# EAGLE schematic ESLv2 (EAGLE 9.6.2)
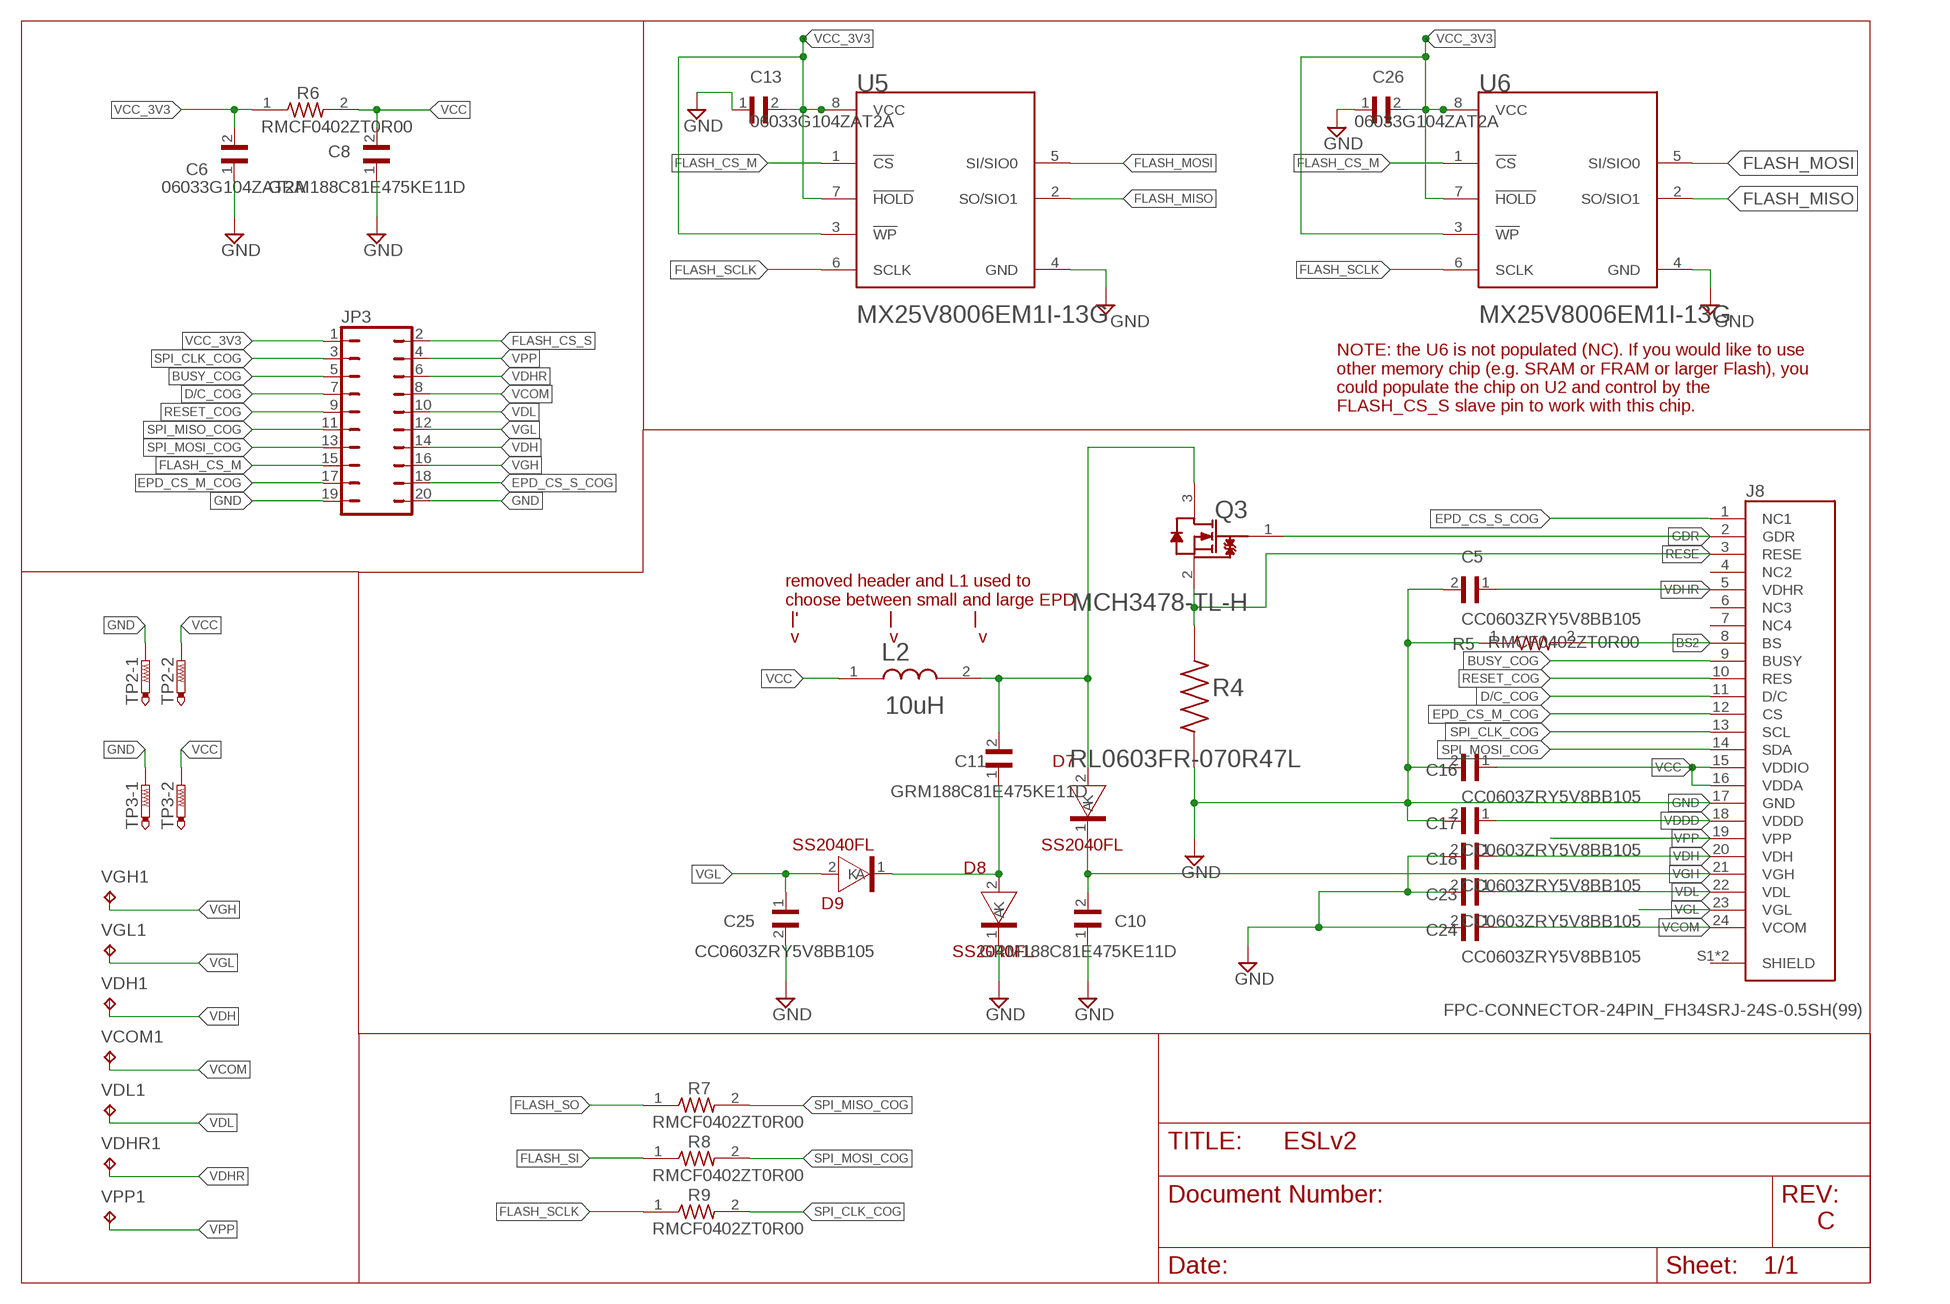
[diagram p0: schematic, sheet 1]

## Parts
C5  CC0603ZRY5V8BB105  [CAPC1608X90]
C6  06033G104ZAT2A  [CAPC1608X90N]
C8  GRM188C81E475KE11D  [CAPC1608X100N]
C10  GRM188C81E475KE11D  [CAPC1608X100N]
C11  GRM188C81E475KE11D  [CAPC1608X100N]
C13  06033G104ZAT2A  [CAPC1608X90N]
C16  CC0603ZRY5V8BB105  [CAPC1608X90]
C17  CC0603ZRY5V8BB105  [CAPC1608X90]
C18  CC0603ZRY5V8BB105  [CAPC1608X90]
C23  CC0603ZRY5V8BB105  [CAPC1608X90]
C24  CC0603ZRY5V8BB105  [CAPC1608X90]
C25  CC0603ZRY5V8BB105  [CAPC1608X90]
C26  06033G104ZAT2A  [CAPC1608X90N]
D7  SS2040FL  [SOD-123FL]
D8  SS2040FL  [SOD-123FL]
D9  SS2040FL  [SOD-123FL]
J8  FPC-CONNECTOR-24PIN_FH34SRJ-24S-0.5SH(99)  [FPC-CONNECTOR-24PIN_HRS_FH34SRJ-24S-0.5SH(99)]
JP3  JP10Q  [JP10Q]
L2  MURATA_LQH3NPZ100MMELMURATA_LQH3NPZ100MMEL_0_0  [MURATA_LQH3NPZ100MMEL_0]
Q3  ON_SEMICONDUCTOR_MCH3478-TL-HON_SEMICONDUCTOR_MCH3478-TL-H_0_0  [ON_SEMICONDUCTOR_MCH3478-TL-H_0]
R4  RL0603FR-070R47L  [RESC1608X55N]
R5  RMCF0402ZT0R00  [RESC1005X40]
R6  RMCF0402ZT0R00  [RESC1005X40]
R7  RMCF0402ZT0R00  [RESC1005X40]
R8  RMCF0402ZT0R00  [RESC1005X40]
R9  RMCF0402ZT0R00  [RESC1005X40]
TP2  PTR2  [P2-38-17]
TP3  PTR2  [P2-38-17]
U5  MACRONIX_MX25V8006EM1I-13GMACRONIX_MX25V8006EM1I-13G_0_0  [MACRONIX_MX25V8006EM1I-13G_0]
U6  MACRONIX_MX25V8006EM1I-13GMACRONIX_MX25V8006EM1I-13G_0_0  [MACRONIX_MX25V8006EM1I-13G_0]
VCOM1  TPB1,27  [B1,27]
VDH1  TPB1,27  [B1,27]
VDHR1  TPB1,27  [B1,27]
VDL1  TPB1,27  [B1,27]
VGH1  TPB1,27  [B1,27]
VGL1  TPB1,27  [B1,27]
VPP1  TPB1,27  [B1,27]

## Nets
BS2: C6.1 C8.1 C10.1 C13.1 C25.2 C26.1 D8.1(K) J8.8(BS) R5.2 U5.4(GND) U6.4(GND) ; supply symbol labelled GND
BUSY_COG: J8.9(BUSY) JP3.5
D/C_COG: J8.11(D/C) JP3.7
EPD_CS_M_COG: J8.12(CS) JP3.17
EPD_CS_S_COG: J8.1(NC1) JP3.18
FLASH_CS_M: JP3.15 U5.1(!CS!) U6.1(!CS!)
FLASH_CS_S: JP3.2
FLASH_MISO: U5.2(SO/SIO1) U6.2(SO/SIO1)
FLASH_MOSI: U5.5(SI/SIO0) U6.5(SI/SIO0)
FLASH_SCLK: R9.1 U5.6(SCLK) U6.6(SCLK)
FLASH_SI: R8.1
FLASH_SO: R7.1
GDR: J8.2(GDR) Q3.1(G)
GND: C5.2 C16.2 C17.2 C18.2 C23.2 C24.2 J8.17(GND) JP3.19 JP3.20 R4.1 R5.1 TP2.TP-1 TP3.TP-1
N$1: C11.2 D7.2(A) L2.2 Q3.3(D)
N$15: C11.1 D8.2(A) D9.1(K)
RESE: J8.3(RESE) Q3.2(S) R4.2
RESET_COG: J8.10(RES) JP3.9
SPI_CLK_COG: J8.13(SCL) JP3.3 R9.2
SPI_MISO_COG: JP3.11 R7.2
SPI_MOSI_COG: J8.14(SDA) JP3.13 R8.2
VCC: C8.2 C16.1 J8.15(VDDIO) J8.16(VDDA) L2.1 R6.2 TP2.TP-2 TP3.TP-2
VCC_3V3: C6.2 C13.2 C26.2 JP3.1 R6.1 U5.3(!WP!) U5.7(!HOLD!) U5.8(VCC) U6.3(!WP!) U6.7(!HOLD!) U6.8(VCC)
VCOM: C24.1 J8.24(VCOM) JP3.8 VCOM1.TP
VDDD: C17.1 J8.18(VDDD)
VDH: C18.1 J8.20(VDH) JP3.14 VDH1.TP
VDHR: C5.1 J8.5(VDHR) JP3.6 VDHR1.TP
VDL: C23.1 J8.22(VDL) JP3.10 VDL1.TP
VGH: C10.2 D7.1(K) J8.21(VGH) JP3.16 VGH1.TP
VGL: C25.1 D9.2(A) J8.23(VGL) JP3.12 VGL1.TP
VPP: J8.19(VPP) JP3.4 VPP1.TP
Unconnected: J8.4(NC2) J8.6(NC3) J8.7(NC4) J8.S1(SHIELD) J8.S2(SHIELD)

## Notes on the sheet
- NOTE: the U6 is not populated (NC). If you would like to use 
  other memory chip (e.g. SRAM or FRAM or larger Flash), you 
  could populate the chip on U2 and control by the 
  FLASH_CS_S slave pin to work with this chip.
- removed header and L1 used to 
  choose between small and large EPD
   |'                  |                |
   v                  v                v
- C

## Library data of the parts
C5 C16-C18 C23-C25 = CAP 1uF:CC0603ZRY5V8BB105: Cap 1uF 25VDC Y5V -20% to 80% SMD 0603 Paper T/R; DESCRIPTION: 1µF -20%, +80% 25V Ceramic Capacitor Y5V (F) 0603 (1608 Metric); DIGI-KEY_PART_NUMBER: 311-1829-1-ND; MF: Yageo; MP: CC0603ZRY5V8BB105; PACKAGE: 0603 Yageo; PURCHASE-URL: https://pricing.snapeda.com/search/part/CC0603ZRY5V8BB105/?ref=eda
C6 C13 C26 = CAP 100nF:06033G104ZAT2A: 0603 100 nF 25 V -20 / +80 % Tolerance Y5V SMT Multilayer Ceramic Capacitor; DESCRIPTION: Cap Ceramic 0.1uF 25V Y5V -20% to 80% Pad SMD 0603 85°C T/R; MF: AVX; MP: 06033G104ZAT2A; PACKAGE: None; PURCHASE-URL: https://pricing.snapeda.com/search/part/06033G104ZAT2A/?ref=eda
C8 C10 C11 = CAP 4.7uF:GRM188C81E475KE11D: Cap Ceramic 4.7uF 25V X6S 10% Pad SMD 0603 105C T/R Check prices <https://pricing.snapeda.com/parts/GRM188C81E475KE11D/Murata/view-part?ref=eda>; AVAILABILITY: In Stock; DESCRIPTION: SMD Capacitor X6S(EIA) with Capacitance: 4.7uF Tol. 10%. Rated Voltage: 25Vdc; MF: Murata; MP: GRM188C81E475KE11D; PACKAGE: 1608 Murata; PRICE: None; PURCHASE-URL: https://pricing.snapeda.com/search/part/GRM188C81E475KE11D/?ref=eda
D7-D9 = DIODE:SS2040FL: Check prices <https://pricing.snapeda.com/parts/SS2040FL/Panjit/view-part?ref=eda>; AVAILABILITY: In Stock; DESCRIPTION: Schottky Diodes & Rectifiers GP/TR/13/RoHS/10K/SOD-123FL/SKY/SOD/SSM-20AAFL/SSM20FL-QI02/PJ///; MF: Panjit; MP: SS2040FL; PACKAGE: None; PRICE: None; PURCHASE-URL: https://pricing.snapeda.com/search/part/SS2040FL/?ref=eda
J8 = ESL:FPC-CONNECTOR-24PIN_FH34SRJ-24S-0.5SH(99): FFC & FPC Connectors Check prices <https://pricing.snapeda.com/parts/FH34SRJ-24S-0.5SH%2899%29/Hirose%20Electric/view-part?ref=eda>; AVAILABILITY: In Stock; DESCRIPTION: 24 Position FFC, FPC Connector Contacts, Top and Bottom 0.020 (0.50mm) Surface Mount, Right Angle; MF: Hirose Electric; MP: FH34SRJ-24S-0.5SH(99); PACKAGE: None; PRICE: None; PURCHASE-URL: https://pricing.snapeda.com/search/part/FH34SRJ-24S-0.5SH(99)/?ref=eda
JP3 = jumper:JP10Q: JUMPER
L2 = IND 10uH:MURATA_LQH3NPZ100MMEL: Wire Wound Ferrite Inductor for Power Lines For Automotive 10μH ±20% 0.228Ω 1280mA 1212; AMBIENT_TEMPERATURE_RANGE_HIGH: +105°C; AMBIENT_TEMPERATURE_RANGE_LOW: -40°C; AUTOMOTIVE: Yes; AUTOMOTIVE_GRADE: Grade 1; CENTROID_NOT_SPECIFIED: No; COMPOSITION: Wirewound; CORE_MATERIAL: Ferrite; DATASHEET: https://www.murata.com/en-us/products/productdetail?partno=LQH3NPZ100MME%23; DEVICE_CLASS_L1: Passive Components; DEVICE_CLASS_L2: Inductors; DEVICE_CLASS_L3: Fixed Inductors; FOOTPRINT_VARIANT_NAME_0: Recommended_Land_Pattern; HEIGHT: 1.5mm; INDUCTANCE: 10uH; LEAD_FREE: Yes; MF: Murata; MFG_PACKAGE_IDENT: LQH3NPH_ME; MFG_PACKAGE_IDENT_COMPONENT_ID: a63315cd171c542c; MFG_PACKAGE_IDENT_DATE: 0; MFG_PACKAGE_IDENT_REV: 0; MPN: LQH3NPZ100MMEL; PACKAGE: 1212.0; PREFIX: L; RMS_CURRENT: 1280mA; ROHS: Yes; SATURATION_CURRENT: 810mA; SELF_RESONANT_FREQUENCY: 20MHz; SERIES_RESISTANCE: 0.228Ω; SHIELDING: true; TEMPERATURE_RANGE_HIGH: +125°C; TEMPERATURE_RANGE_LOW: -40°C; TEST_FREQUENCY: 1MHz; TOLERANCE: 0.2; VERIFICATION_VERSION: 0.0.0.3
Q3 = MOSFET:ON_SEMICONDUCTOR_MCH3478-TL-H: ONSC-NMOS-G1S2D3-3_J; CHANNEL_POLARITY: N Channel; CIIVA_IDS: 837008; CISS_TYP_PF: 130; COMPONENT_LINK_1_DESCRIPTION: Manufacturer URL; COMPONENT_LINK_1_URL: http://www.onsemi.com/; COMPONENT_LINK_3_DESCRIPTION: Package Specification; COMPONENT_LINK_3_URL: http://www.onsemi.com/pub_link/Collateral/EN7354-D.PDF; CONFIGURATION: Single; COSS_TYP_PF: 21; CRSS_TYP_PF: 14; DATASHEET: http://www.onsemi.cn/pub_link/Collateral/ENAA1353-D.PDF; FOOTPRINT_VARIANT_NAME_0: Manufacturer Recommended; IMPORTED: yes; IMPORTED_FROM: vault; IMPORT_TS: 1521851194; MF: On Semiconductor; MOUNTING_TECHNOLOGY: Surface Mount; MPN: MCH3478-TL-H; PACKAGE: MCPH-3; PACKAGE_DESCRIPTION: 3-Pin Small Outline Transistor, Body 2 x 1.6 mm, Pitch 0.65 mm; PACKAGE_TYPE: SC-70FL / MCPH-3; PACKING: Tape and Reel; PREFIX: Q; RELEASE_DATE: 1407149804; ROHS: No; VAULT_GUID: 93CF8D5F-116E-4A84-9C4D-567819B75567; VAULT_REVISION: 4F433114-B412-42D1-93FA-4D10C81BF666; VBRDSS_MIN_V: 30; VGSTH_MAX_V: 1.3; VGS_MAX_V: 12
R4 = RES .47ohm:RL0603FR-070R47L: Surface Mount Thick Film Resistor, RL Series, 0.47 ohm, 100 mW, - 1%, 50 V, 0603 [1608 Metric] Check prices <https://pricing.snapeda.com/parts/RL0603FR-070R47L/Yageo/view-part?ref=eda>; AVAILABILITY: In Stock; DESCRIPTION: 470 mOhms ±1% 0.1W, 1/10W Chip Resistor 0603 (1608 Metric) Automotive AEC-Q200, Current Sense, Moisture Resistant Thick Film; MF: Yageo; MP: RL0603FR-070R47L; PACKAGE: 1608 Yageo; PRICE: None; PURCHASE-URL: https://pricing.snapeda.com/search/part/RL0603FR-070R47L/?ref=eda
R5-R9 = RMCF0402ZT0R00:RMCF0402ZT0R00: General Purpose Thick Film Surface Mount Chip Resistor Check prices <https://pricing.snapeda.com/parts/RMCF0402ZT0R00/Stackpole%20Electronics/view-part?ref=eda>; AVAILABILITY: In Stock; DESCRIPTION: 0 Ohms Jumper 0.063W, 1/16W Chip Resistor 0402 (1005 Metric) Automotive AEC-Q200 Thick Film; MF: Stackpole Electronics; MP: RMCF0402ZT0R00; PACKAGE: 0402 Stackpole Electronics; PRICE: None; PURCHASE-URL: https://pricing.snapeda.com/search/part/RMCF0402ZT0R00/?ref=eda
TP2 TP3 = testpad:PTR2: TEST PIN
U5 U6 = Flash Memory:MACRONIX_MX25V8006EM1I-13G: FLASH - NOR Memory IC 8Mb (1M x 8) SPI 75MHz 8-SOP; 3DS_PART_NUMBER: 521-00003; ACCESS_TIME: 9us; AMBIENT_TEMPERATURE_RANGE_HIGH: +85°C; AMBIENT_TEMPERATURE_RANGE_LOW: -40°C; CENTROID_NOT_SPECIFIED: No; DATASHEET: https://media.digikey.com/pdf/Data%20Sheets/Macronix/MX25V8006E.pdf; DEVICE_CLASS_L1: Integrated Circuits (ICs); DEVICE_CLASS_L2: Memory; DEVICE_CLASS_L3: Flash; DIGIKEY_DESCRIPTION: IC FLASH 8MBIT 75MHZ 8SOP; DIGIKEY_PART_NUMBER: 1092-1118-ND; FOOTPRINT_PARAMETERS_0: {"fp_type":"SOIC_mini","params":{"N":{"nom":8,"long name":"Number of leads","min":null,"max":null,"short name":"N","type":"count"},"A":{"nom":false,"long name":"Height","min":false,"max":1750000,"short name":"A","type":"measurement"},"A1":{"nom":150000,"long name":"Package clearance","min":100000,"max":200000,"short name":"A1","type":"measurement"},"A2":{"nom":1450000,"long name":"Package height","min":1350000,"max":1550000,"short name":"A2","type":"measurement"},"D":{"nom":4900000,"long name":"Package length","min":4770000,"max":5030000,"short name":"D","type":"measurement"},"E":{"nom":5990000,"long name":"Width w/ leads","min":5800000,"max":6200000,"short name":"E","type":"measurement"},"E1":{"nom":3900000,"long name":"Package width","min":3800000,"max":4000000,"short name":"E1","type":"measurement"},"B":{"nom":410000,"long name":"Lead width","min":360000,"max":510000,"short name":"B","type":"measurement"},"C":{"nom":200000,"long name":"Lead thickness","min":150000,"max":250000,"short name":"C","type":"measurement"},"e":{"nom":1270000,"long name":"Lead pitch","min":null,"max":null,"short name":"e","type":"measurement"},"L":{"nom":660000,"long name":"Lead foot length","min":460000,"max":860000,"short name":"L","type":"measurement"},"PHI":{"nom":5,"long name":"Lead foot angle","min":0,"max":8,"short name":"PHI","type":"measurement"},"HT":{"default":"No","long name":"Thermal pad","type":"multichoiceparent","short name":"HT","children":[]},"offset x":{"nom":0,"long name":"X Center offset","min":null,"max":null,"short name":"offset x","type":"measurement"},"offset y":{"nom":0,"long name":"Y Center offset","min":null,"max":null,"short name":"offset y","type":"measurement"},"LS":{"default":"Rounded rectangle","long name":"Land shape","type":"multichoice","short name":"LS"},"LS1":{"default":"Rectangle","long name":"Land shape (Pin 1)","type":"multichoice","short name":"LS1"},"solder toe":{"nom":550000,"long name":"Solder fillet (toe)","min":null,"max":null,"short name":"solder toe","type":"fixedmeasurement"},"solder heel":{"nom":450000,"long name":"Solder fillet (heel)","min":null,"max":null,"short name":"solder heel","type":"fixedmeasurement"},"solder side":{"nom":50000,"long name":"Solder fillet (side)","min":null,"max":null,"short name":"solder side","type":"fixedmeasurement"},"courtyard":{"nom":500000,"long name":"Courtyard","min":null,"max":null,"short name":"courtyard","type":"fixedmeasurement"},"SF":{"default":"A","long name":"Packing level","type":"multichoiceparent","short name":"SF","help":"http://support.upverter.com/customer/portal/articles/978783-what-is-a-footprint-packing-level","children":["solder toe","solder heel","solder side","courtyard"]}}}; FOOTPRINT_PARAMETERS_1: {"fp_type":"SOIC_mini","params":{"N":{"nom":8,"long name":"Number of leads","min":null,"max":null,"short name":"N","type":"count"},"A":{"nom":false,"long name":"Height","min":false,"max":1750000,"short name":"A","type":"measurement"},"A1":{"nom":150000,"long name":"Package clearance","min":100000,"max":200000,"short name":"A1","type":"measurement"},"A2":{"nom":1450000,"long name":"Package height","min":1350000,"max":1550000,"short name":"A2","type":"measurement"},"D":{"nom":4900000,"long name":"Package length","min":4770000,"max":5030000,"short name":"D","type":"measurement"},"E":{"nom":5990000,"long name":"Width w/ leads","min":5800000,"max":6200000,"short name":"E","type":"measurement"},"E1":{"nom":3900000,"long name":"Package width","min":3800000,"max":4000000,"short name":"E1","type":"measurement"},"B":{"nom":410000,"long name":"Lead width","min":360000,"max":510000,"short name":"B","type":"measurement"},"C":{"nom":200000,"long name":"Lead thickness","min":150000,"max":250000,"short name":"C","type":"measurement"},"e":{"nom":1270000,"long name":"Lead pitch","min":null,"max":null,"short name":"e","type":"measurement"},"L":{"nom":660000,"long name":"Lead foot length","min":460000,"max":860000,"short name":"L","type":"measurement"},"PHI":{"nom":5,"long name":"Lead foot angle","min":0,"max":8,"short name":"PHI","type":"measurement"},"HT":{"default":"No","long name":"Thermal pad","type":"multichoiceparent","short name":"HT","children":[]},"offset x":{"nom":0,"long name":"X Center offset","min":null,"max":null,"short name":"offset x","type":"measurement"},"offset y":{"nom":0,"long name":"Y Center offset","min":null,"max":null,"short name":"offset y","type":"measurement"},"LS":{"default":"Rounded rectangle","long name":"Land shape","type":"multichoice","short name":"LS"},"LS1":{"default":"Rectangle","long name":"Land shape (Pin 1)","type":"multichoice","short name":"LS1"},"solder toe":{"nom":350000,"long name":"Solder fillet (toe)","min":null,"max":null,"short name":"solder toe","type":"fixedmeasurement"},"solder heel":{"nom":350000,"long name":"Solder fillet (heel)","min":null,"max":null,"short name":"solder heel","type":"fixedmeasurement"},"solder side":{"nom":30000,"long name":"Solder fillet (side)","min":null,"max":null,"short name":"solder side","type":"fixedmeasurement"},"courtyard":{"nom":250000,"long name":"Courtyard","min":null,"max":null,"short name":"courtyard","type":"fixedmeasurement"},"SF":{"default":"B","long name":"Packing level","type":"multichoiceparent","short name":"SF","help":"http://support.upverter.com/customer/portal/articles/978783-what-is-a-footprint-packing-level","children":["solder toe","solder heel","solder side","courtyard"]}}}; FOOTPRINT_PARAMETERS_2: {"fp_type":"SOIC_mini","params":{"N":{"nom":8,"long name":"Number of leads","min":null,"max":null,"short name":"N","type":"count"},"A":{"nom":false,"long name":"Height","min":false,"max":1750000,"short name":"A","type":"measurement"},"A1":{"nom":150000,"long name":"Package clearance","min":100000,"max":200000,"short name":"A1","type":"measurement"},"A2":{"nom":1450000,"long name":"Package height","min":1350000,"max":1550000,"short name":"A2","type":"measurement"},"D":{"nom":4900000,"long name":"Package length","min":4770000,"max":5030000,"short name":"D","type":"measurement"},"E":{"nom":5990000,"long name":"Width w/ leads","min":5800000,"max":6200000,"short name":"E","type":"measurement"},"E1":{"nom":3900000,"long name":"Package width","min":3800000,"max":4000000,"short name":"E1","type":"measurement"},"B":{"nom":410000,"long name":"Lead width","min":360000,"max":510000,"short name":"B","type":"measurement"},"C":{"nom":200000,"long name":"Lead thickness","min":150000,"max":250000,"short name":"C","type":"measurement"},"e":{"nom":1270000,"long name":"Lead pitch","min":null,"max":null,"short name":"e","type":"measurement"},"L":{"nom":660000,"long name":"Lead foot length","min":460000,"max":860000,"short name":"L","type":"measurement"},"PHI":{"nom":5,"long name":"Lead foot angle","min":0,"max":8,"short name":"PHI","type":"measurement"},"HT":{"default":"No","long name":"Thermal pad","type":"multichoiceparent","short name":"HT","children":[]},"offset x":{"nom":0,"long name":"X Center offset","min":null,"max":null,"short name":"offset x","type":"measurement"},"offset y":{"nom":0,"long name":"Y Center offset","min":null,"max":null,"short name":"offset y","type":"measurement"},"LS":{"default":"Rounded rectangle","long name":"Land shape","type":"multichoice","short name":"LS"},"LS1":{"default":"Rectangle","long name":"Land shape (Pin 1)","type":"multichoice","short name":"LS1"},"solder toe":{"nom":150000,"long name":"Solder fillet (toe)","min":null,"max":null,"short name":"solder toe","type":"fixedmeasurement"},"solder heel":{"nom":250000,"long name":"Solder fillet (heel)","min":null,"max":null,"short name":"solder heel","type":"fixedmeasurement"},"solder side":{"nom":10000,"long name":"Solder fillet (side)","min":null,"max":null,"short name":"solder side","type":"fixedmeasurement"},"courtyard":{"nom":100000,"long name":"Courtyard","min":null,"max":null,"short name":"courtyard","type":"fixedmeasurement"},"SF":{"default":"C","long name":"Packing level","type":"multichoiceparent","short name":"SF","help":"http://support.upverter.com/customer/portal/articles/978783-what-is-a-footprint-packing-level","children":["solder toe","solder heel","solder side","courtyard"]}}}; FOOTPRINT_URL: http://www.macronix.com/Lists/ApplicationNote/Attachments/1897/AN0239V1%20-%20Macronix%20150mil%208SOP_6x5mm8WSON_dual%20layout.pdf; FOOTPRINT_VARIANT_NAME_0: IPC_A; FOOTPRINT_VARIANT_NAME_1: IPC_B; FOOTPRINT_VARIANT_NAME_2: IPC_C; FOOTPRINT_VARIANT_NAME_3: Recommended_Land_Pattern; FREQUENCY: 75MHz; HEIGHT: 1.75mm; INTERFACE: SPI; IPC_LAND_PATTERN_NAME: SOIC127P599X175-8; LEAD_FREE: yes; MAX_SUPPLY_VOLTAGE: 3.6V; MEMORY_SIZE: 8MB; MEMORY_TYPE: FLASH; MF: Macronix; MFG_PACKAGE_IDENT: SOP-8; MFG_PACKAGE_IDENT_DATE: 11-26-03; MFG_PACKAGE_IDENT_REV: 6; MIN_SUPPLY_VOLTAGE: 2.35V; MPN: MX25V8006EM1I-13G; NOMINAL_SUPPLY_CURRENT: 12mA; PACKAGE: SOP8; PREFIX: U; ROHS: yes; STANDOFF_HEIGHT: 0.15mm; TEMPERATURE_RANGE_HIGH: +85°C; TEMPERATURE_RANGE_LOW: -40°C
VCOM1 VDH1 VDHR1 VDL1 VGH1 VGL1 VPP1 = testpad:TP: Test pad

## Net classes
1 power: width 0.203 mm